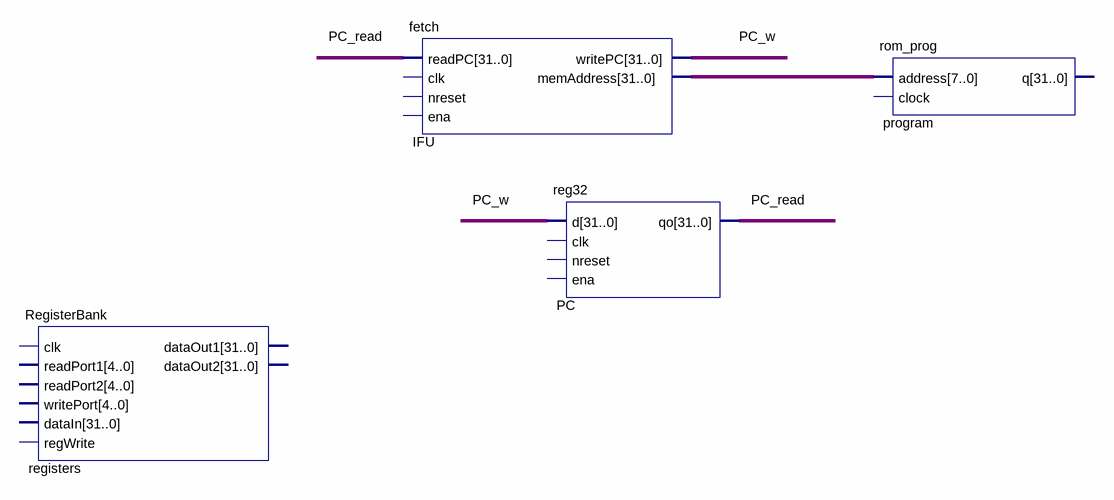
[diagram p0: schematic sheet]
// Quartus schematic diagram.bdf as structural Verilog: 4 symbols, 0 pins
module diagram (
);

  wire PC_read, PC_w;
  wire [31:0] IFU_memaddress;

  RegisterBank registers ();  // open: clk, readPort1, readPort2, writePort, dataIn, regWrite, dataOut1, dataOut2
  fetch IFU (.readPC({32{PC_read}}), .writePC(PC_w), .memAddress(IFU_memaddress));  // open: clk, nreset, ena
  reg32 PC (.d({32{PC_w}}), .qo(PC_read));  // open: clk, nreset, ena
  rom_prog \program  (.address(IFU_memaddress));  // open: clock, q
endmodule
